# EAGLE design LM386M-brkout (EAGLE 5.11)
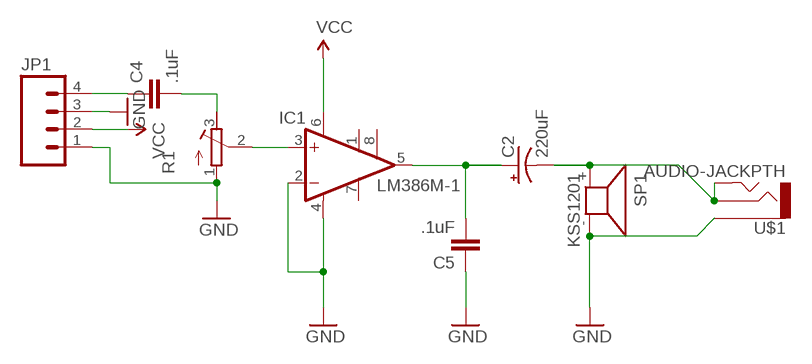
[diagram p0: schematic, sheet 1]

## Parts
C2  220uF  CAP_POLC  [PANASONIC_C]
C4  .1uF  CAP0805  [0805]
C5  .1uF  CAP0805  [0805]
IC1  LM386M-1  [SO08]
JP1  M04PTH  [1X04]
R1  R-TRIMM3103  [RTRIM3103]
SP1  KSS1201  [KSS1201]
U$1  AUDIO-JACKPTH  [AUDIO-JACK]

## Nets
GND: C5.1 IC1.2(-IN) IC1.4(GND) JP1.1 JP1.3 R1.1(E) SP1.- U$1.1
N$1: IC1.3(+IN) R1.2(S)
N$3: C2.+ C5.2 IC1.5(OUT)
N$5: C2.- SP1.+ U$1.2 U$1.5
N$6: C4.2 R1.3(A)
N$8: C4.1 JP1.4
VCC: IC1.6(VS) JP1.2
Unconnected: IC1.1(GAIN) IC1.7(BYPASS) IC1.8(GAIN)

## Library data of the parts
C2 = SparkFun:CAP_POL: Capacitor Polarized These are standard SMD and PTH capacitors. Normally 10uF, 47uF, and 100uF in electrolytic and tantalum varieties. Always verify the external diameter of the through hole cap, it varies with capacity, voltage, and manufacturer. The EIA devices should be standard.
C4 C5 = SparkFun:CAP: Capacitor Standard 0603 ceramic capacitor, and 0.1" leaded capacitor.
IC1 = linear:LM386?-*: Low Voltage Audio Power Amplifier Source: http://cache.national.com/ds/LM/LM386.pdf
JP1 = SparkFun:M04: Header 4 Standard 4-pin 0.1" header. Use with straight break away headers (SKU : PRT-00116), right angle break away headers (PRT-00553), swiss pins (PRT-00743), machine pins (PRT-00117), and female headers (PRT-00115). Molex polarized connector foot print use with SKU : PRT-08231 with associated crimp pins and housings.
R1 = rcl:R-TRIMM: Trimm resistor
SP1 = buzzer:KSS1201: SPEAKER Source: Schukat
U$1 = SparkFun:AUDIO-JACK: 3.5mm Audio Jack Simple 3.5mm common PCB mount audio jack. SKU: PRT-08032

## Board
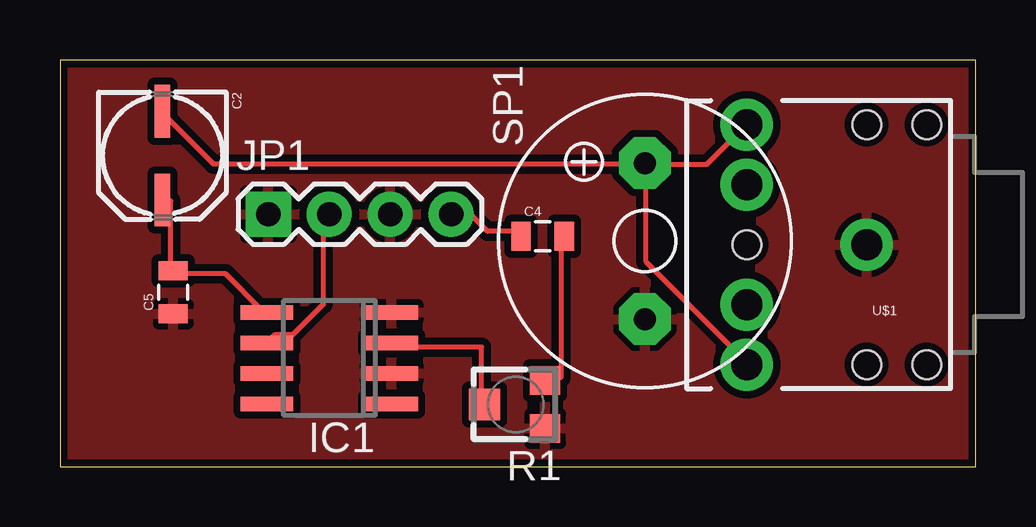
[diagram p1: board, top side]

Size 38.18 x 16.94 mm. Coordinates in mm from the lower left corner, seen from the top.
Outline: 0,0 38.18,0 38.18,16.94 0,16.94 0,0
Copper layers (1*16): Top 0.0356mm / dielectric 1.5011mm / Bottom 0.0356mm
Design rules "SparkFun-mod": minimum track width 8mil, minimum drill 20mil, track to track 12mil, track to pad 12mil, pad to pad 8mil, via to via 8mil, smd to smd 8mil, copper to edge 12mil, drill to drill 8mil, minimum pad ring 12mil, minimum via ring 10mil, stop-mask expansion 4mil, vias tented up to drill 25mil, thermal gap 10mil

### Footprints (pad centres in the part's own frame; a part is rotated, then mirrored left to right if it is on the bottom)
PANASONIC_C = smd 2.2 x 0.65: + 1.9,-0.2; - -1.8,-0.2
0805 = smd 0.8 x 1.2: 1 -0.9,0; 2 0.9,0
SO08 = smd 0.6 x 2.2: 1 -1.905,-2.6; 2 -0.635,-2.6; 3 0.635,-2.6; 4 1.905,-2.6; 5 1.905,2.6; 6 0.635,2.6; 7 -0.635,2.6; 8 -1.905,2.6
1X04 = drill 1.016 pad 1.88 square: 1 0,0 | drill 1.016 pad 1.88 round: 2 2.54,0; 3 5.08,0; 4 7.62,0
RTRIM3103 = smd 1.2 x 1.25: 1 -1,-1.225; 3 1,-1.225 | smd 1.3 x 1.3: 2 0,1.3
KSS1201 = drill 0.914 pad 2.159 octagon: + 3.251,0; - -3.251,0
AUDIO-JACK = drill 1.3 pad 2.184 round: 1 0,0; 2 5,5; 3 5,2.5; 4 5,-2.5; 5 5,-5 | hole 1.2: 0,5; -2.5,5; -2.5,-5; 0,-5; 5,0

### Placement (x,y rotation side)
C2  4.47,13 270 top
C4  20.12,9.6 0 top
C5  4.72,7.26 90 top
IC1  11.23,4.52 90 top
JP1  8.69,10.52 0 top
R1  19,2.59 90 top
SP1  24.38,9.4 90 top
U$1  33.63,9.25 180 top

### Tracks (layer width: path | path; a pad name or v marks a point on that pad's centre or on a via)
GND
  pour Top: -0.56,17.88 40.39,17.83 40.39,-0.81 -0.56,-0.76
N$1
  Top 0.203: R1.2 17.58,2.69 17.58,4.98 14.02,4.98 IC1.3
N$3
  Top 0.203: C2.+ 4.37,11.07 4.62,11.07 4.62,8.28 C5.2 4.88,8.03 6.91,8.03 8.43,6.5 IC1.5
N$5
  Top 0.203: C2.- 4.37,14.63 6.4,12.6 24.18,12.6 SP1.+ 24.43,12.6 | 24.43,12.6 24.43,8.53 28.5,4.47 U$1.2 | 24.43,12.6 26.97,12.6 28.5,14.12 U$1.5
N$6
  Top 0.203: C4.2 20.88,9.55 20.88,3.71 20.37,3.71 R1.3
N$8
  Top 0.203: C4.1 19.1,9.8 17.83,9.8 17.07,10.57 16.31,10.57 JP1.4
VCC
  Top 0.203: IC1.6 8.69,5.23 8.94,5.49 9.7,5.49 10.97,6.76 10.97,10.31 11.23,10.31 JP1.2